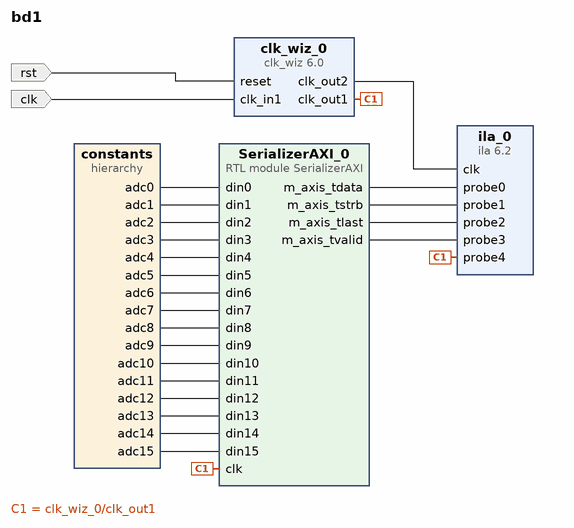
[diagram p0: block diagram of the top level]
# Vivado block design bd1, xc7z020clg400-1, Vivado 2019.1
create_bd_design bd1

create_bd_port -dir I -type rst rst
set_property -dict {CONFIG.POLARITY ACTIVE_HIGH} [get_bd_ports rst]
create_bd_port -dir I -type clk clk
set_property -dict {CONFIG.FREQ_HZ 125000000 CONFIG.PHASE 0.000} [get_bd_ports clk]

create_bd_cell -type hier constants
create_bd_cell -type module -reference SerializerAXI SerializerAXI_0
create_bd_cell -type ip -vlnv xilinx.com:ip:clk_wiz:6.0 clk_wiz_0
set_property -dict [list \
  CONFIG.CLKIN1_JITTER_PS 80.0 \
  CONFIG.CLKOUT1_DRIVES BUFG \
  CONFIG.CLKOUT1_JITTER 279.759 \
  CONFIG.CLKOUT1_PHASE_ERROR 526.941 \
  CONFIG.CLKOUT1_REQUESTED_DUTY_CYCLE 50.0 \
  CONFIG.CLKOUT1_REQUESTED_OUT_FREQ 10.000 \
  CONFIG.CLKOUT2_DRIVES BUFG \
  CONFIG.CLKOUT2_JITTER 184.855 \
  CONFIG.CLKOUT2_PHASE_ERROR 526.941 \
  CONFIG.CLKOUT2_REQUESTED_DUTY_CYCLE 50.0 \
  CONFIG.CLKOUT2_USED true \
  CONFIG.CLKOUT3_DRIVES BUFG \
  CONFIG.CLKOUT3_JITTER 125.199 \
  CONFIG.CLKOUT3_PHASE_ERROR 526.941 \
  CONFIG.CLKOUT3_REQUESTED_DUTY_CYCLE 50.0 \
  CONFIG.CLKOUT3_USED true \
  CONFIG.CLKOUT4_DRIVES BUFG \
  CONFIG.CLKOUT4_JITTER 125.199 \
  CONFIG.CLKOUT4_PHASE_ERROR 526.941 \
  CONFIG.CLKOUT4_REQUESTED_DUTY_CYCLE 50.0 \
  CONFIG.CLKOUT4_USED true \
  CONFIG.CLKOUT5_DRIVES BUFG \
  CONFIG.CLKOUT6_DRIVES BUFG \
  CONFIG.CLKOUT7_DRIVES BUFG \
  CONFIG.CLK_IN1_BOARD_INTERFACE sys_clock \
  CONFIG.ENABLE_CLOCK_MONITOR false \
  CONFIG.FEEDBACK_SOURCE FDBK_AUTO \
  CONFIG.MMCM_BANDWIDTH LOW \
  CONFIG.MMCM_CLKFBOUT_MULT_F 21.000 \
  CONFIG.MMCM_CLKIN1_PERIOD 8.000 \
  CONFIG.MMCM_CLKOUT0_DIVIDE_F 87.500 \
  CONFIG.MMCM_CLKOUT1_DIVIDE 9 \
  CONFIG.MMCM_COMPENSATION ZHOLD \
  CONFIG.MMCM_DIVCLK_DIVIDE 3 \
  CONFIG.NUM_OUT_CLKS 4 \
  CONFIG.PRIMITIVE MMCM \
  CONFIG.USE_BOARD_FLOW true \
  CONFIG.USE_LOCKED false \
  CONFIG.USE_SPREAD_SPECTRUM true \
] [get_bd_cells clk_wiz_0]
create_bd_cell -type ip -vlnv xilinx.com:ip:ila:6.2 ila_0
set_property -dict [list \
  CONFIG.C_ENABLE_ILA_AXI_MON false \
  CONFIG.C_MONITOR_TYPE Native \
  CONFIG.C_NUM_OF_PROBES 5 \
  CONFIG.C_PROBE0_WIDTH 32 \
  CONFIG.C_PROBE1_WIDTH 4 \
] [get_bd_cells ila_0]

# ---- hierarchy /constants ----
current_bd_instance /constants
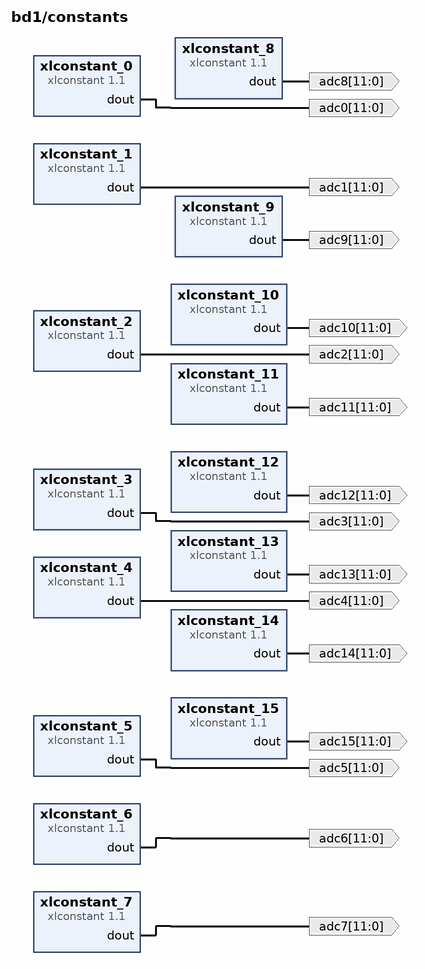
[diagram p1: block diagram inside /constants]
create_bd_pin -dir O -from 11 -to 0 adc0
create_bd_pin -dir O -from 11 -to 0 adc1
create_bd_pin -dir O -from 11 -to 0 adc2
create_bd_pin -dir O -from 11 -to 0 adc3
create_bd_pin -dir O -from 11 -to 0 adc4
create_bd_pin -dir O -from 11 -to 0 adc5
create_bd_pin -dir O -from 11 -to 0 adc6
create_bd_pin -dir O -from 11 -to 0 adc7
create_bd_pin -dir O -from 11 -to 0 adc8
create_bd_pin -dir O -from 11 -to 0 adc9
create_bd_pin -dir O -from 11 -to 0 adc10
create_bd_pin -dir O -from 11 -to 0 adc11
create_bd_pin -dir O -from 11 -to 0 adc12
create_bd_pin -dir O -from 11 -to 0 adc13
create_bd_pin -dir O -from 11 -to 0 adc14
create_bd_pin -dir O -from 11 -to 0 adc15

create_bd_cell -type ip -vlnv xilinx.com:ip:xlconstant:1.1 xlconstant_13
set_property -dict {CONFIG.CONST_VAL 14 CONFIG.CONST_WIDTH 12} [get_bd_cells xlconstant_13]
create_bd_cell -type ip -vlnv xilinx.com:ip:xlconstant:1.1 xlconstant_9
set_property -dict {CONFIG.CONST_VAL 10 CONFIG.CONST_WIDTH 12} [get_bd_cells xlconstant_9]
create_bd_cell -type ip -vlnv xilinx.com:ip:xlconstant:1.1 xlconstant_14
set_property -dict {CONFIG.CONST_VAL 15 CONFIG.CONST_WIDTH 12} [get_bd_cells xlconstant_14]
create_bd_cell -type ip -vlnv xilinx.com:ip:xlconstant:1.1 xlconstant_15
set_property -dict {CONFIG.CONST_VAL 16 CONFIG.CONST_WIDTH 12} [get_bd_cells xlconstant_15]
create_bd_cell -type ip -vlnv xilinx.com:ip:xlconstant:1.1 xlconstant_0
set_property -dict {CONFIG.CONST_WIDTH 12} [get_bd_cells xlconstant_0]
create_bd_cell -type ip -vlnv xilinx.com:ip:xlconstant:1.1 xlconstant_1
set_property -dict {CONFIG.CONST_VAL 2 CONFIG.CONST_WIDTH 12} [get_bd_cells xlconstant_1]
create_bd_cell -type ip -vlnv xilinx.com:ip:xlconstant:1.1 xlconstant_2
set_property -dict {CONFIG.CONST_VAL 3 CONFIG.CONST_WIDTH 12} [get_bd_cells xlconstant_2]
create_bd_cell -type ip -vlnv xilinx.com:ip:xlconstant:1.1 xlconstant_3
set_property -dict {CONFIG.CONST_VAL 4 CONFIG.CONST_WIDTH 12} [get_bd_cells xlconstant_3]
create_bd_cell -type ip -vlnv xilinx.com:ip:xlconstant:1.1 xlconstant_4
set_property -dict {CONFIG.CONST_VAL 5 CONFIG.CONST_WIDTH 12} [get_bd_cells xlconstant_4]
create_bd_cell -type ip -vlnv xilinx.com:ip:xlconstant:1.1 xlconstant_5
set_property -dict {CONFIG.CONST_VAL 6 CONFIG.CONST_WIDTH 12} [get_bd_cells xlconstant_5]
create_bd_cell -type ip -vlnv xilinx.com:ip:xlconstant:1.1 xlconstant_10
set_property -dict {CONFIG.CONST_VAL 11 CONFIG.CONST_WIDTH 12} [get_bd_cells xlconstant_10]
create_bd_cell -type ip -vlnv xilinx.com:ip:xlconstant:1.1 xlconstant_6
set_property -dict {CONFIG.CONST_VAL 7 CONFIG.CONST_WIDTH 12} [get_bd_cells xlconstant_6]
create_bd_cell -type ip -vlnv xilinx.com:ip:xlconstant:1.1 xlconstant_11
set_property -dict {CONFIG.CONST_VAL 12 CONFIG.CONST_WIDTH 12} [get_bd_cells xlconstant_11]
create_bd_cell -type ip -vlnv xilinx.com:ip:xlconstant:1.1 xlconstant_7
set_property -dict {CONFIG.CONST_VAL 8 CONFIG.CONST_WIDTH 12} [get_bd_cells xlconstant_7]
create_bd_cell -type ip -vlnv xilinx.com:ip:xlconstant:1.1 xlconstant_12
set_property -dict {CONFIG.CONST_VAL 13 CONFIG.CONST_WIDTH 12} [get_bd_cells xlconstant_12]
create_bd_cell -type ip -vlnv xilinx.com:ip:xlconstant:1.1 xlconstant_8
set_property -dict {CONFIG.CONST_VAL 9 CONFIG.CONST_WIDTH 12} [get_bd_cells xlconstant_8]

# ---- connections ----

current_bd_instance /constants
connect_bd_net [get_bd_pins xlconstant_0/dout] [get_bd_pins adc0]
connect_bd_net [get_bd_pins xlconstant_1/dout] [get_bd_pins adc1]
connect_bd_net [get_bd_pins xlconstant_2/dout] [get_bd_pins adc2]
connect_bd_net [get_bd_pins xlconstant_3/dout] [get_bd_pins adc3]
connect_bd_net [get_bd_pins xlconstant_4/dout] [get_bd_pins adc4]
connect_bd_net [get_bd_pins xlconstant_5/dout] [get_bd_pins adc5]
connect_bd_net [get_bd_pins xlconstant_6/dout] [get_bd_pins adc6]
connect_bd_net [get_bd_pins xlconstant_7/dout] [get_bd_pins adc7]
connect_bd_net [get_bd_pins xlconstant_8/dout] [get_bd_pins adc8]
connect_bd_net [get_bd_pins xlconstant_9/dout] [get_bd_pins adc9]
connect_bd_net [get_bd_pins xlconstant_10/dout] [get_bd_pins adc10]
connect_bd_net [get_bd_pins xlconstant_11/dout] [get_bd_pins adc11]
connect_bd_net [get_bd_pins xlconstant_12/dout] [get_bd_pins adc12]
connect_bd_net [get_bd_pins xlconstant_13/dout] [get_bd_pins adc13]
connect_bd_net [get_bd_pins xlconstant_14/dout] [get_bd_pins adc14]
connect_bd_net [get_bd_pins xlconstant_15/dout] [get_bd_pins adc15]

current_bd_instance /
connect_bd_net [get_bd_pins constants/adc0] [get_bd_pins SerializerAXI_0/din0]
connect_bd_net [get_bd_pins constants/adc1] [get_bd_pins SerializerAXI_0/din1]
connect_bd_net [get_bd_pins constants/adc2] [get_bd_pins SerializerAXI_0/din2]
connect_bd_net [get_bd_pins constants/adc3] [get_bd_pins SerializerAXI_0/din3]
connect_bd_net [get_bd_pins constants/adc4] [get_bd_pins SerializerAXI_0/din4]
connect_bd_net [get_bd_pins constants/adc5] [get_bd_pins SerializerAXI_0/din5]
connect_bd_net [get_bd_pins constants/adc6] [get_bd_pins SerializerAXI_0/din6]
connect_bd_net [get_bd_pins constants/adc7] [get_bd_pins SerializerAXI_0/din7]
connect_bd_net [get_bd_pins constants/adc8] [get_bd_pins SerializerAXI_0/din8]
connect_bd_net [get_bd_pins constants/adc9] [get_bd_pins SerializerAXI_0/din9]
connect_bd_net [get_bd_pins constants/adc10] [get_bd_pins SerializerAXI_0/din10]
connect_bd_net [get_bd_pins constants/adc11] [get_bd_pins SerializerAXI_0/din11]
connect_bd_net [get_bd_pins constants/adc12] [get_bd_pins SerializerAXI_0/din12]
connect_bd_net [get_bd_pins constants/adc13] [get_bd_pins SerializerAXI_0/din13]
connect_bd_net [get_bd_pins constants/adc14] [get_bd_pins SerializerAXI_0/din14]
connect_bd_net [get_bd_pins constants/adc15] [get_bd_pins SerializerAXI_0/din15]
connect_bd_net [get_bd_pins clk_wiz_0/clk_out1] [get_bd_pins SerializerAXI_0/clk] [get_bd_pins ila_0/probe4]
connect_bd_net [get_bd_pins clk_wiz_0/clk_out2] [get_bd_pins ila_0/clk]
connect_bd_net [get_bd_pins SerializerAXI_0/m_axis_tdata] [get_bd_pins ila_0/probe0]
connect_bd_net [get_bd_pins SerializerAXI_0/m_axis_tstrb] [get_bd_pins ila_0/probe1]
connect_bd_net [get_bd_pins SerializerAXI_0/m_axis_tlast] [get_bd_pins ila_0/probe2]
connect_bd_net [get_bd_pins SerializerAXI_0/m_axis_tvalid] [get_bd_pins ila_0/probe3]
connect_bd_net -net reset_rtl_1 [get_bd_ports rst] [get_bd_pins clk_wiz_0/reset]
connect_bd_net -net sys_clock_1 [get_bd_ports clk] [get_bd_pins clk_wiz_0/clk_in1]

validate_bd_design
save_bd_design
